# Altium project Machine_side.PrjPcb
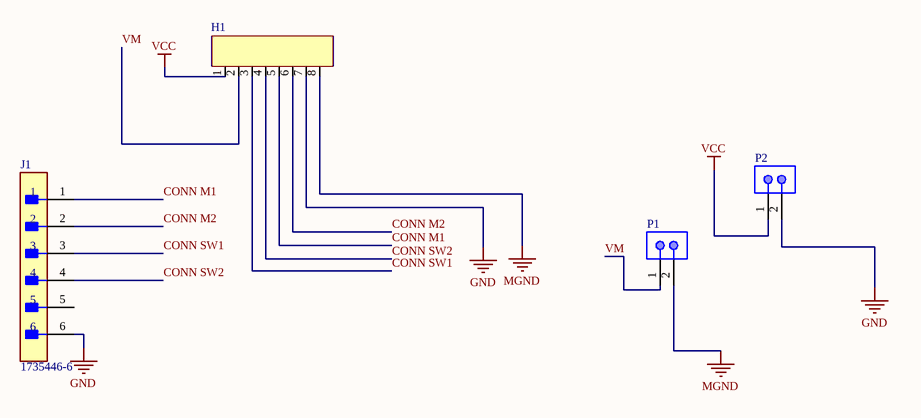
[diagram p0: Mach_side_sch.SchDoc]
1 sheet, 4 parts. Net scope: global (net labels, ports and power ports of the same name join across sheets).
Board file: Mach_side_pcb.PcbDoc

## Sheet Mach_side_sch.SchDoc
size A2

### Parts
H1  1747785-1  [1747785-1]  (value not drawn)
J1  1735446-6  [FP-1735446-6-MFG]
P1  B2B-XH-A(LF)(SN)  [JST-B2B-XH-A_V]  (value not drawn)
P2  B2B-XH-A(LF)(SN)  [JST-B2B-XH-A_V]  (value not drawn)

### Nets
GND: H1.7 J1.6 P2.2
MGND: H1.8 P1.2
VCC: H1.1 P2.1
CONN M1: H1.5 J1.1
CONN M2: H1.6 J1.2
CONN SW1: H1.3 J1.3
CONN SW2: H1.4 J1.4
VM: H1.2 P1.1

Not connected (* = marked no-connect by the designer): J1 5

### Library data of the parts
J1 = CMP-03369-000087-1: CONN HEADER VERT 6POS 2MM; Manufacturer: TE; Conn Gender: Male; Conn Orientation: Vertical; Current Rating: 3A; Voltage Rating: 100V; Number Of Contacts: 6; Device Class L1: Connectors; RoHS: TRUE; Pitch: 2mm; Number Of Rows: 1; Device Class L2: Headers and Wire Housings; Digikey Description: CONN HEADER VERT 6POS 2MM; Category: Conn; Automotive: No; Device Class L3: unset; Lead Free: Yes; Package: 1735446-6; Height: 6.37mm; Temperature: -25°C to +85°C; Contact Material: Tin,Nickel; Mouser Description: Headers & Wire Housings 6 POS HDR VERT 2.0mm; Octopart: https://octopart.com/1735446-6-te+connectivity-42205942; Temperature Range High: +85°C; ComponentLink2URL: https://www.te.com/usa-en/product-1735446-6.html; ComponentLink2Description: Datasheet; Temperature Range Low: -25°C; Manufacturer Part Number: 1735446-6
P1 P2 = CMP-2000-05888-1: Male Header, Pitch 2.5 mm, 1 x 2 Position, Height 7 mm, Tail Length 3.4 mm, -25 to 85 degC, RoHS, Bulk; Manufacturer: JST; No of Positions: 2; Pitch: 2.5mm; Style/Orientation: StraightHeader/Plug; Datasheet Version: 05/2016; Package Description: Male Header, Pitch 2.5 mm, 1 x 2 Position, Height 7 mm, Tail Length 3.4 mm; Package Reference: B2B-XH-A; Mounting Technology: ThroughHole; Type: ShroudedHeader; Datasheet URL: http://www.jst-mfg.com/product/pdf/eng/eXH.pdf; Manufacturer URL: http://www.jst.com/home2.html; Termination: Crimp